# EAGLE schematic iot_wifi (EAGLE 7.1.0)
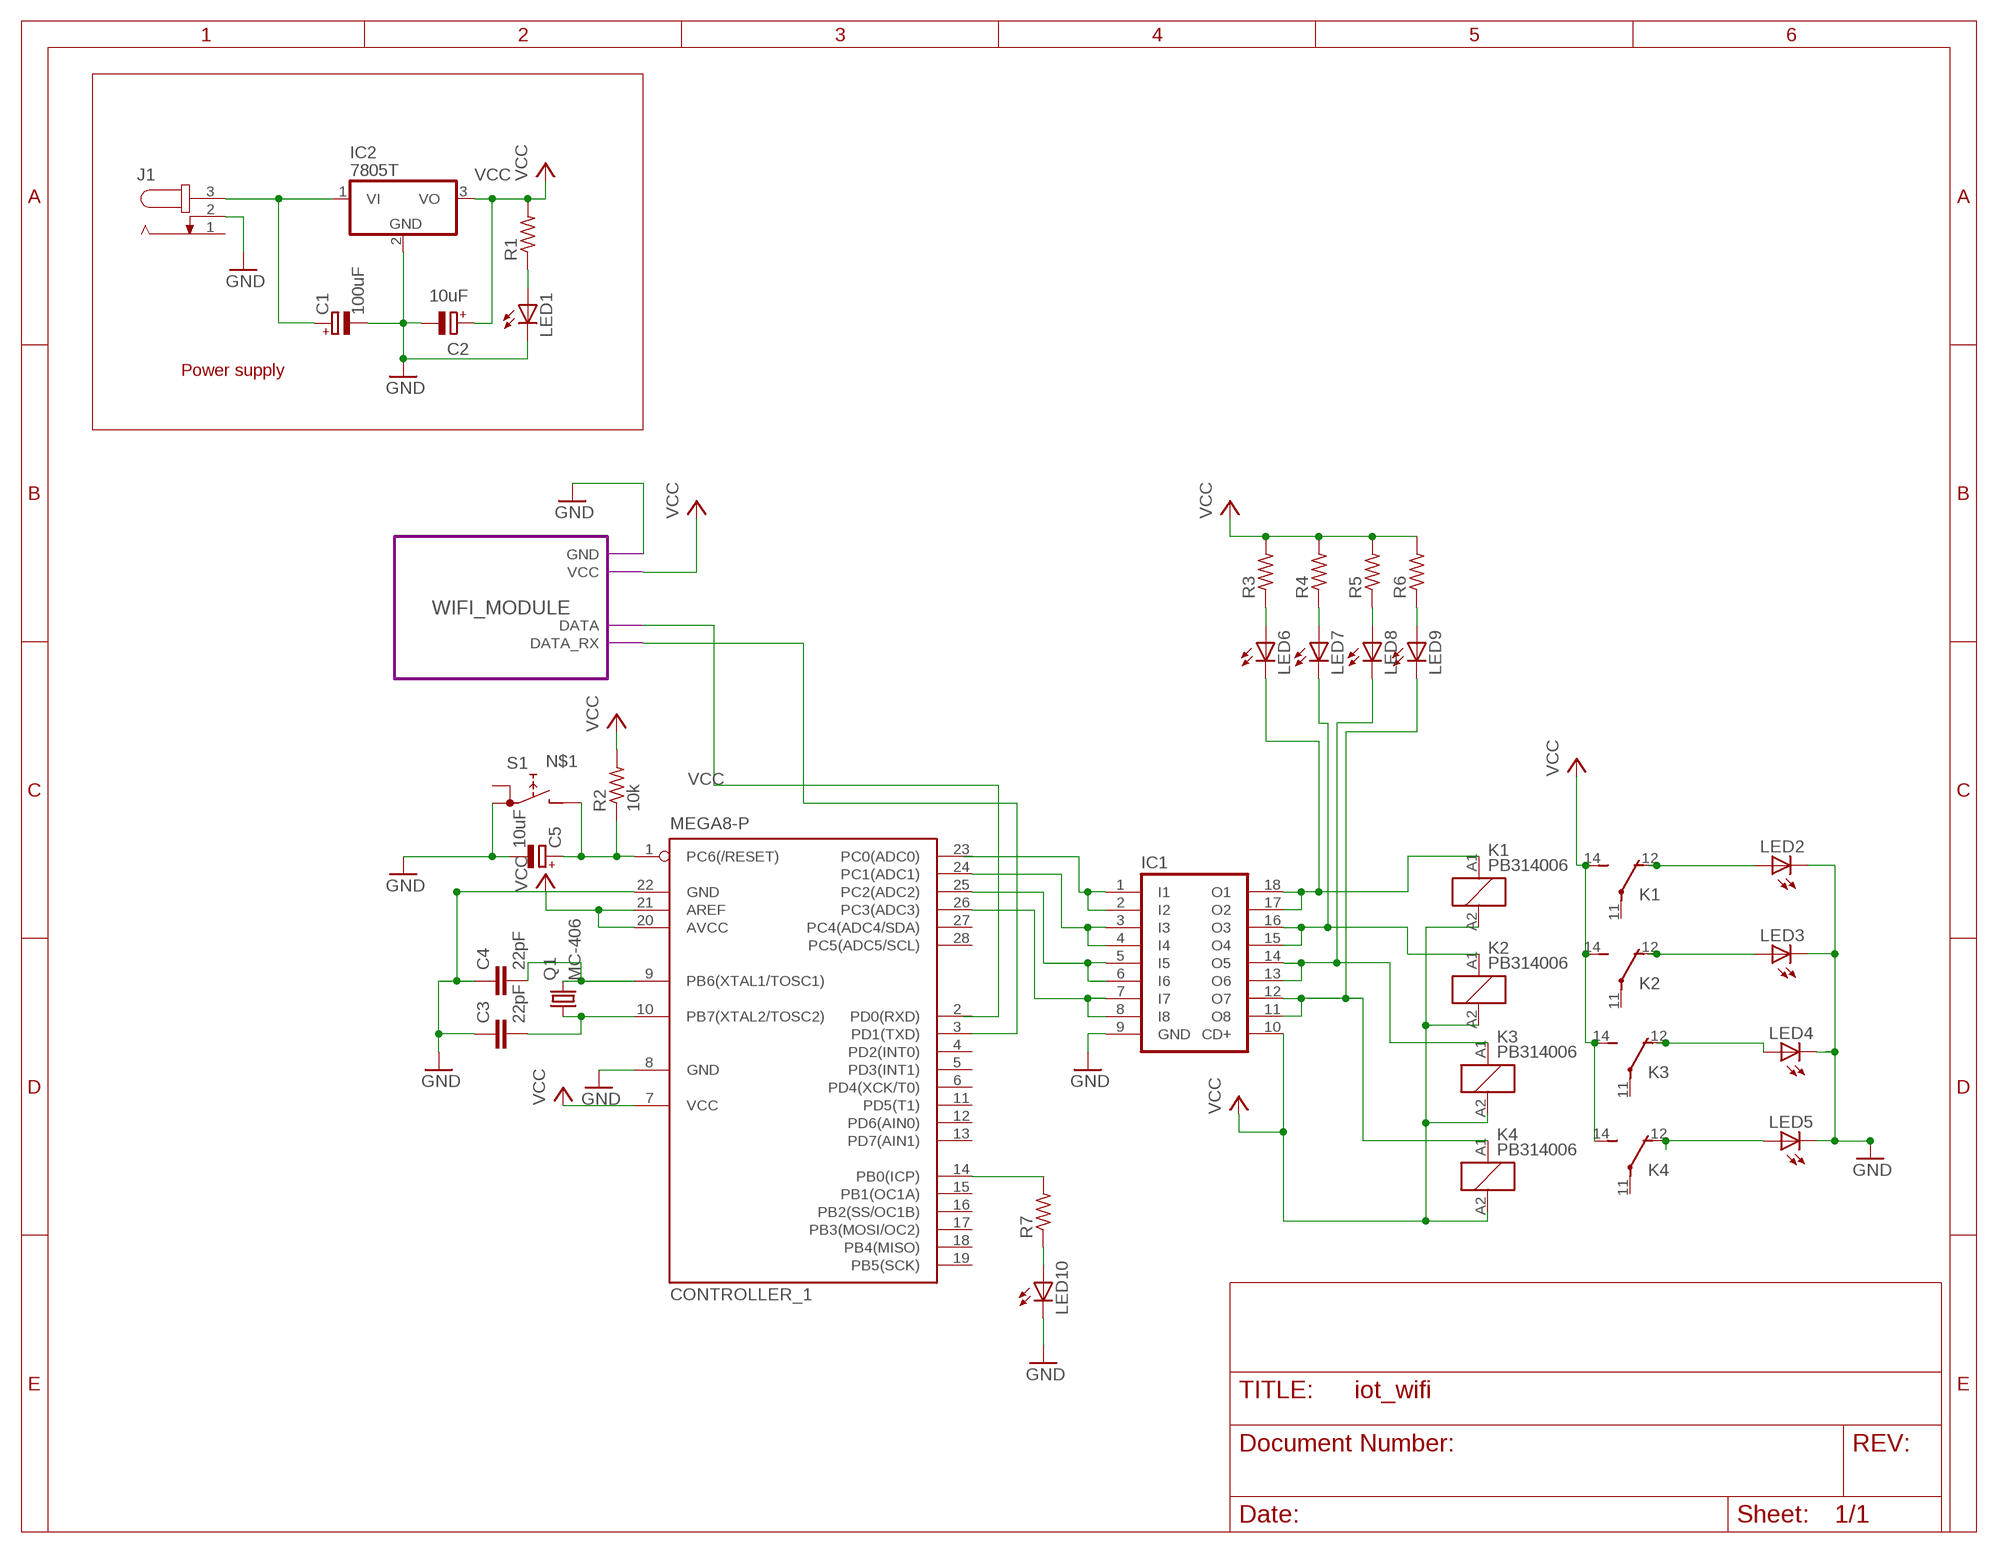
[diagram p0: schematic, sheet 1]

## Parts
C1  100uF  CPOL-EU085CS-1AR  [085CS_1AR]
C2  10uF  CPOL-EU085CS-1AR  [085CS_1AR]
C3  22pF  C-EU050-025X075  [C050-025X075]
C4  22pF  C-EU050-025X075  [C050-025X075]
C5  10uF  CPOL-EU085CS-1AR  [085CS_1AR]
CONTROLLER_1  MEGA8-P  [DIL28-3]
IC1  ULN2803A  [DIL18]
IC2  7805T  [TO220H]
J1  JACK-PLUG1  [SPC4078]
K1  PB314006  [PB]
K2  PB314006  [PB]
K3  PB314006  [PB]
K4  PB314006  [PB]
LED1  LAP4-BOTTOM  [P47F-BOTTOM]
LED2  LAP4-BOTTOM  [P47F-BOTTOM]
LED3  LAP4-BOTTOM  [P47F-BOTTOM]
LED4  LAP4-BOTTOM  [P47F-BOTTOM]
LED5  LAP4-BOTTOM  [P47F-BOTTOM]
LED6  LAP4-BOTTOM  [P47F-BOTTOM]
LED7  LAP4-BOTTOM  [P47F-BOTTOM]
LED8  LAP4-BOTTOM  [P47F-BOTTOM]
LED9  LAP4-BOTTOM  [P47F-BOTTOM]
LED10  LAP4-BOTTOM  [P47F-BOTTOM]
Q1  MC-406  [MC-406]
R1  R-US_0204/2V  [0204V]
R2  10k  R-US_0204/2V  [0204V]
R3  R-US_0204/2V  [0204V]
R4  R-US_0204/2V  [0204V]
R5  R-US_0204/2V  [0204V]
R6  R-US_0204/2V  [0204V]
R7  R-US_0204/2V  [0204V]
S1  RDT1034  [RDT1034]

## Module instances
WIFI_MODULE = RFID

## Nets
GND: C1.- C2.- C3.1 C4.1 C5.- CONTROLLER_1.8(GND) CONTROLLER_1.22(GND) IC1.9(GND) IC2.2(GND) J1.2 LED1.C LED2.C LED3.C LED4.C LED5.C LED10.C S1.A1 ; port WIFI_MODULE.GND
GND1: IC1.17(O2) IC1.18(O1) K1.A1 LED6.C
GND2: IC1.15(O4) IC1.16(O3) K2.A1 LED7.C
GND3: IC1.13(O6) IC1.14(O5) K3.A1 LED8.C
GND4: IC1.11(O8) IC1.12(O7) K4.A1 LED9.C
N$1: C5.+ CONTROLLER_1.1(PC6(/RESET)) R2.1 S1.B
N$2: C1.+ IC2.1(VI) J1.3
N$3: C4.2 CONTROLLER_1.9(PB6(XTAL1/TOSC1)) Q1.4
N$4: C3.2 CONTROLLER_1.10(PB7(XTAL2/TOSC2)) Q1.1
N$5: IC1.1(I1) IC1.2(I2)
N$6: CONTROLLER_1.24(PC1(ADC1)) IC1.3(I3) IC1.4(I4)
N$7: LED10.A R7.1
N$8: LED6.A R3.1
N$9: CONTROLLER_1.25(PC2(ADC2)) IC1.5(I5) IC1.6(I6)
N$10: LED7.A R4.1
N$11: LED1.A R1.1
N$12: CONTROLLER_1.2(PD0(RXD)) ; port WIFI_MODULE.DATA
N$13: K1.12(2:O) LED2.A
N$14: K2.12(2:O) LED3.A
N$15: K3.12(2:O) LED4.A
N$16: CONTROLLER_1.3(PD1(TXD)) ; port WIFI_MODULE.DATA_RX
N$17: K4.12(2:O) LED5.A
N$18: CONTROLLER_1.26(PC3(ADC3)) IC1.7(I7) IC1.8(I8)
N$19: CONTROLLER_1.14(PB0(ICP)) R7.2
N$20: LED8.A R5.1
N$23: LED9.A R6.1
VCC: C2.+ CONTROLLER_1.7(VCC) CONTROLLER_1.20(AVCC) CONTROLLER_1.21(AREF) IC1.10(CD+) IC2.3(VO) K1.14(2:S) K1.A2 K2.14(2:S) K2.A2 K3.14(2:S) K3.A2 K4.14(2:S) K4.A2 R1.2 R2.2 R3.2 R4.2 R5.2 R6.2 ; port WIFI_MODULE.VCC
Unconnected: CONTROLLER_1.4(PD2(INT0)) CONTROLLER_1.5(PD3(INT1)) CONTROLLER_1.6(PD4(XCK/T0)) CONTROLLER_1.11(PD5(T1)) CONTROLLER_1.12(PD6(AIN0)) CONTROLLER_1.13(PD7(AIN1)) CONTROLLER_1.15(PB1(OC1A)) CONTROLLER_1.16(PB2(SS/OC1B)) CONTROLLER_1.17(PB3(MOSI/OC2)) CONTROLLER_1.18(PB4(MISO)) CONTROLLER_1.19(PB5(SCK)) CONTROLLER_1.23(PC0(ADC0)) CONTROLLER_1.27(PC4(ADC4/SDA)) CONTROLLER_1.28(PC5(ADC5/SCL)) J1.1 K1.11(2:P) K2.11(2:P) K3.11(2:P) K4.11(2:P) S1.A

## Notes on the sheet
- Power supply

## Library data of the parts
C1 C2 C5 = rcl:CPOL-EU: POLARIZED CAPACITOR, European symbol
C3 C4 = rcl:C-EU: CAPACITOR, European symbol
CONTROLLER_1 = atmel:MEGA8-P: MICROCONTROLLER 8 Kbytes FLASH, 1 kbytes SRAM, 512 bytes EEPROM, USART, 4-channel 10 bit ADC, 2-channel 8 bit ADC Pin compatible with Atmega48, ATMega88, ATMega168 Source: avr.lbr; OC_FARNELL: unknown; OC_NEWARK: unknown
IC1 = uln-udn:ULN2803A: DRIVER ARRAY
IC2 = linear:78*: Positive VOLTAGE REGULATOR Source: http://cache.national.com/ds/LM/LM78L05.pdf http://www.fairchildsemi.com/ds/LM/LM7805.pdf
J1 = con-jack:JACK-PLUG: DC POWER JACK Power Jack, DC, Right Angle, Through Hole, Rated 5A at 16VDC, PC Terminals Distributor: Farnell (www.Farnell.de) Drawing: 84N1161.pdf / 84N1162.pdf Manufacturer: SPC Technology (www.spctechnology.com) Type: SPC4077 / SPC 4078; OC_FARNELL: unknown; OC_NEWARK: unknown
K1-K4 = relay:PB?14*: Miniature Power PCB Relay SCHRACK 1pole 10 A Source: http://www.schrack.com/.. 5846.pdf; OC_FARNELL: unknown; OC_NEWARK: unknown
LED1-LED10 = led:*P4: PointLED® Enhanced Thinfilm LED TOP & BOTTOM mount LS P47F, LR P47F, LA P47F, LY P47F, LT P4SG, LB P4SG, LW P4SG Source: http://catalog.osram-os.com .. LA_LR_LS_LY_P47F_Pb_free.pdf
Q1 = crystal:MC-406: kHz RANGE CRYSTAL UNIT SMD Source: MC-306_405_406_E07X.PDF Homepage <http://www.epsontoyocom.co.jp>; MF: BANNER ENGINEERING CORPORATION; MPN: MQDMC-406; OC_FARNELL: 1216226; OC_NEWARK: 21H2317
R1-R7 = resistor:R-US_: RESISTOR, American symbol
S1 = switch:RDT1034: PUSH SWITCH www.radiohm.com

## Module RFID
Ports: DATA(out) GND(pwr) VCC(pwr) DATA_RX(in)

### Library data of the parts